# EAGLE design Fishboard (EAGLE 7.7.0)
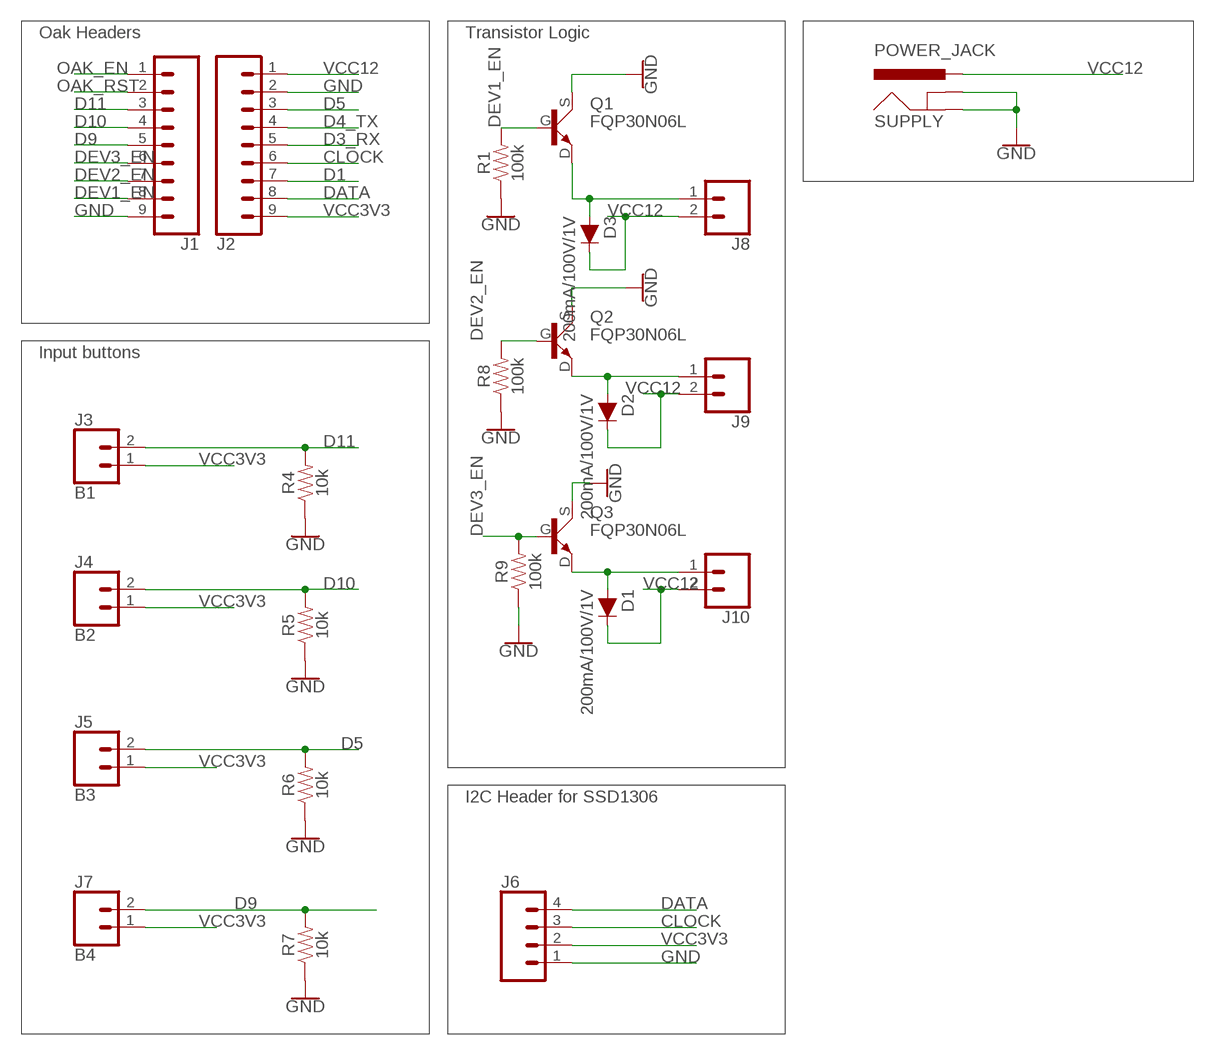
[diagram p0: schematic, sheet 1]

## Parts
D1  200mA/100V/1V  DIODE-KIT  [DIODE-1N4148-KIT]
D2  200mA/100V/1V  DIODE-KIT  [DIODE-1N4148-KIT]
D3  200mA/100V/1V  DIODE-KIT  [DIODE-1N4148-KIT]
J1  CONN_09LOCK  [1X09_LOCK]
J2  CONN_09LOCK  [1X09_LOCK]
J3  B1  CONN_02LOCK  [1X02_LOCK]
J4  B2  CONN_02LOCK  [1X02_LOCK]
J5  B3  CONN_02LOCK  [1X02_LOCK]
J6  CONN_04LOCK  [1X04_LOCK]
J7  B4  CONN_02LOCK  [1X02_LOCK]
J8  CONN_02PTH3  [1X02_LONGPADS]
J9  CONN_02PTH3  [1X02_LONGPADS]
J10  CONN_02PTH3  [1X02_LONGPADS]
Q1  FQP30N06L  [TO220]
Q2  FQP30N06L  [TO220]
Q3  FQP30N06L  [TO220]
R1  100k  100KOHM-HORIZ-1/4W-5%  [AXIAL-0.3]
R4  10k  10KOHM-HORIZ-1/4W-1%  [AXIAL-0.3]
R5  10k  10KOHM-HORIZ-1/4W-1%  [AXIAL-0.3]
R6  10k  10KOHM-HORIZ-1/4W-1%  [AXIAL-0.3]
R7  10k  10KOHM-HORIZ-1/4W-1%  [AXIAL-0.3]
R8  100k  100KOHM-HORIZ-1/4W-5%  [AXIAL-0.3]
R9  100k  100KOHM-HORIZ-1/4W-5%  [AXIAL-0.3]
SUPPLY  POWER_JACK  [POWER_JACK_PTH]

## Nets
CLOCK: J2.6 J6.3
D1: J2.7
D3_RX: J2.5
D4_TX: J2.4
D5: J2.3 J5.2 R6.P$2
D9: J1.5 J7.2 R7.P$2
D10: J1.4 J4.2 R5.P$2
D11: J1.3 J3.2 R4.P$2
DATA: J2.8 J6.4
DEV1_EN: J1.8 Q1.G R1.P$2
DEV2_EN: J1.7 Q2.G R8.P$2
DEV3_EN: J1.6 Q3.G R9.P$2
GND: J1.9 J2.2 J6.1 Q1.S Q2.S Q3.S R1.P$1 R4.P$1 R5.P$1 R6.P$1 R7.P$1 R8.P$1 R9.P$1 SUPPLY.GND SUPPLY.GNDBREAK
N$1: D2.A J9.1 Q2.D
N$2: D3.A J8.1 Q1.D
N$4: D1.A J10.1 Q3.D
OAK_EN: J1.1
OAK_RST: J1.2
VCC3V3: J2.9 J3.1 J4.1 J5.1 J6.2 J7.1
VCC12: D1.C D2.C D3.C J2.1 J8.2 J9.2 J10.2 SUPPLY.PWR

## Notes on the sheet
- Oak Headers | Transistor Logic
- Input buttons
- I2C Header for SSD1306

## Library data of the parts
D1-D3 = SparkFun-DiscreteSemi:DIODE: Diode These are standard reverse protection diodes and small signal diodes. SparkFun Products: SparkFun SparkPunk Sound Kit <https://www.sparkfun.com/products/11177> SparkFun ESP8266 Thing <https://www.sparkfun.com/products/13231>; PROD_ID: DIO-08378
J1 J2 = SparkFun-Connectors:CONN_09: Multi connection point. Often used as Generic Header-pin footprint for 0.1 inch spaced/style header connections On any of the 0.1 inch spaced packages, you can populate with these: Break Away Headers - Straight <https://www.sparkfun.com/products/116> (PRT-00116) Break Away Male Headers - Right Angle <https://www.sparkfun.com/products/553> (PRT-00553) Female Headers <https://www.sparkfun.com/products/115> (PRT-00115) Break Away Headers - Machine Pin <https://www.sparkfun.com/products/117> (PRT-00117) Break Away Female Headers - Swiss Machine Pin <https://www.sparkfun.com/products/743> (PRT-00743) For SCREWTERMINALS and SPRING TERMINALS visit here: Screw Terimnals on SparkFun.com <https://www.sparkfun.com/search/results?term=Screw+Terminals> (5mm/3.5mm/2.54mm spacing) This device is also useful as a general connection point to wire up your design to another part of your project. Our various solder wires solder well into these plated through hole pads. Hook-Up Wire - Assortment (Stranded, 22 AWG) <https://www.sparkfun.com/products/11375> (PRT-11375) Hook-Up Wire - Assortment (Solid Core, 22 AWG) <https://www.sparkfun.com/products/11367> (PRT-11367) View the entire wire category on our website here <https://www.sparkfun.com/categories/141> Special notes: Molex polarized connector foot print use with SKU : PRT-08231 with associated crimp pins and housings. 1MM SMD Version SKU: PRT-10208 NOTES ON THE VARIANTS LOCK and LOCK_LONGPADS... This footprint was designed to help hold the alignment of a through-hole component (i.e. 6-pin header) while soldering it into place. You may notice that each hole has been shifted either up or down by 0.005 of an inch from it's more standard position (which is a perfectly straight line). This slight alteration caused the pins (the squares in the middle) to touch the edges of the holes. Because they are alternating, it causes a "brace" to hold the component in place. 0.005 has proven to be the perfect amount of "off-center" position when using our standard breakaway headers. Although looks a little odd when you look at the bare footprint, once you have a header in there, the alteration is very hard to notice. Also,if you push a header all the way into place, it is covered up entirely on the bottom side.
J3-J5 J7-J10 = SparkFun-Connectors:CONN_02: Multi connection point. Often used as Generic Header-pin footprint for 0.1 inch spaced/style header connections On any of the 0.1 inch spaced packages, you can populate with these: Break Away Headers - Straight <https://www.sparkfun.com/products/116> (PRT-00116) Break Away Male Headers - Right Angle <https://www.sparkfun.com/products/553> (PRT-00553) Female Headers <https://www.sparkfun.com/products/115> (PRT-00115) Break Away Headers - Machine Pin <https://www.sparkfun.com/products/117> (PRT-00117) Break Away Female Headers - Swiss Machine Pin <https://www.sparkfun.com/products/743> (PRT-00743) For SCREWTERMINALS and SPRING TERMINALS visit here: Screw Terimnals on SparkFun.com <https://www.sparkfun.com/search/results?term=Screw+Terminals> (5mm/3.5mm/2.54mm spacing) This device is also useful as a general connection point to wire up your design to another part of your project. Our various solder wires solder well into these plated through hole pads. Hook-Up Wire - Assortment (Stranded, 22 AWG) <https://www.sparkfun.com/products/11375> (PRT-11375) Hook-Up Wire - Assortment (Solid Core, 22 AWG) <https://www.sparkfun.com/products/11367> (PRT-11367) View the entire wire category on our website here <https://www.sparkfun.com/categories/141> Special notes: Molex polarized connector foot print use with: PRT-08233 with associated crimp pins and housings. 2.54_SCREWTERM for use with PRT-10571. 3.5mm Screw Terminal footprints for PRT-08084 5mm Screw Terminal footprints for use with PRT-08432
J6 = SparkFun-Connectors:CONN_04: Multi connection point. Often used as Generic Header-pin footprint for 0.1 inch spaced/style header connections On any of the 0.1 inch spaced packages, you can populate with these: Break Away Headers - Straight <https://www.sparkfun.com/products/116> (PRT-00116) Break Away Male Headers - Right Angle <https://www.sparkfun.com/products/553> (PRT-00553) Female Headers <https://www.sparkfun.com/products/115> (PRT-00115) Break Away Headers - Machine Pin <https://www.sparkfun.com/products/117> (PRT-00117) Break Away Female Headers - Swiss Machine Pin <https://www.sparkfun.com/products/743> (PRT-00743) For SCREWTERMINALS and SPRING TERMINALS visit here: Screw Terimnals on SparkFun.com <https://www.sparkfun.com/search/results?term=Screw+Terminals> (5mm/3.5mm/2.54mm spacing) This device is also useful as a general connection point to wire up your design to another part of your project. Our various solder wires solder well into these plated through hole pads. Hook-Up Wire - Assortment (Stranded, 22 AWG) <https://www.sparkfun.com/products/11375> (PRT-11375) Hook-Up Wire - Assortment (Solid Core, 22 AWG) <https://www.sparkfun.com/products/11367> (PRT-11367) View the entire wire category on our website here <https://www.sparkfun.com/categories/141> Special notes: Molex polarized connector foot print use with SKU : PRT-08231 with associated crimp pins and housings. 1MM SMD Version SKU: PRT-10208; PROD_ID: CONN-09696
Q1-Q3 = fishlib:FQP30N06L
R1 R8 R9 = SparkFun-Resistors:100KOHM: 100kΩ resistor A resistor is a passive two-terminal electrical component that implements electrical resistance as a circuit element. Resistors act to reduce current flow, and, at the same time, act to lower voltage levels within circuits. - Wikipedia; PROD_ID: RES-10686
R4-R7 = SparkFun-Resistors:10KOHM: 10kΩ resistor A resistor is a passive two-terminal electrical component that implements electrical resistance as a circuit element. Resistors act to reduce current flow, and, at the same time, act to lower voltage levels within circuits. - Wikipedia; PROD_ID: RES-12183
SUPPLY = SparkFun-Connectors:POWER_JACK: Power Jack Connector This is the standard 5.5mm barrel jack for power. The PTH is the most common, proven, reliable, footprint. The Slot footprint only works if the mill layer is transmitted to the PCB fab house so be warned. Here are the connectors we sell at SparkFun: DC Barrel Power Jack/Connector <https://www.sparkfun.com/products/119> (PRT-00119) DC Barrel Power Jack/Connector (SMD) <https://www.sparkfun.com/products/12748> (PRT-12748) DC Barrel Jack Adapter - Breadboard Compatible <https://www.sparkfun.com/products/10811> (PRT-10811) It is used on this SparkFun product (and many, many others): SparkFun RedBoard - Programmed with Arduino <https://www.sparkfun.com/products/12757> (DEV-12757) Also, if you need a mating power supply or connector, please check these out: Wall Adapter Power Supply - 9VDC 650mA <https://www.sparkfun.com/products/298> (TOL-00298) DC Barrel Jack Adapter - Male <https://www.sparkfun.com/products/10287> (PRT-10287); PROD_ID: CONN-08197

## Board
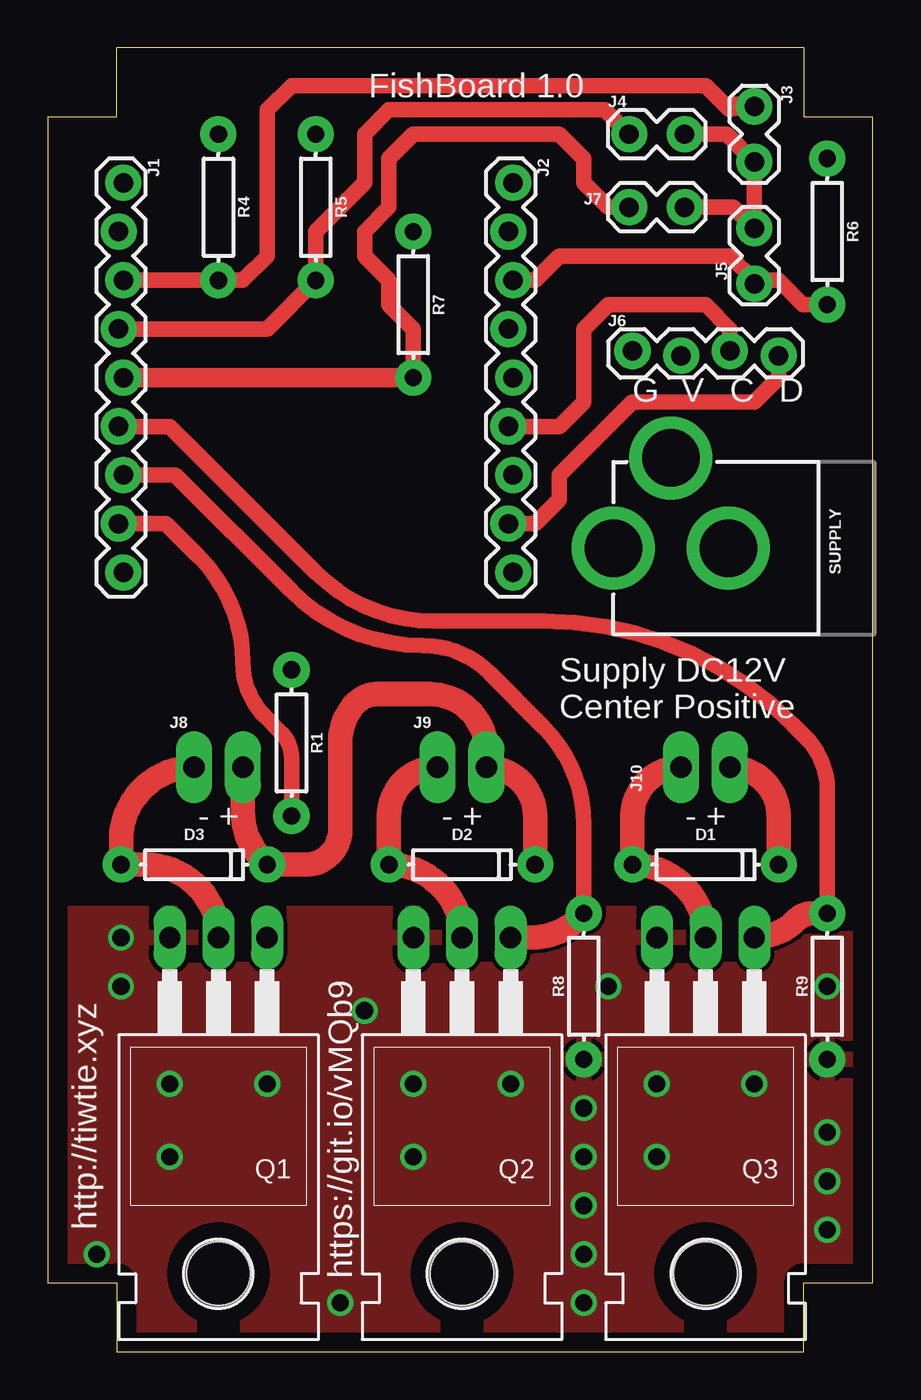
[diagram p1: board, top side]
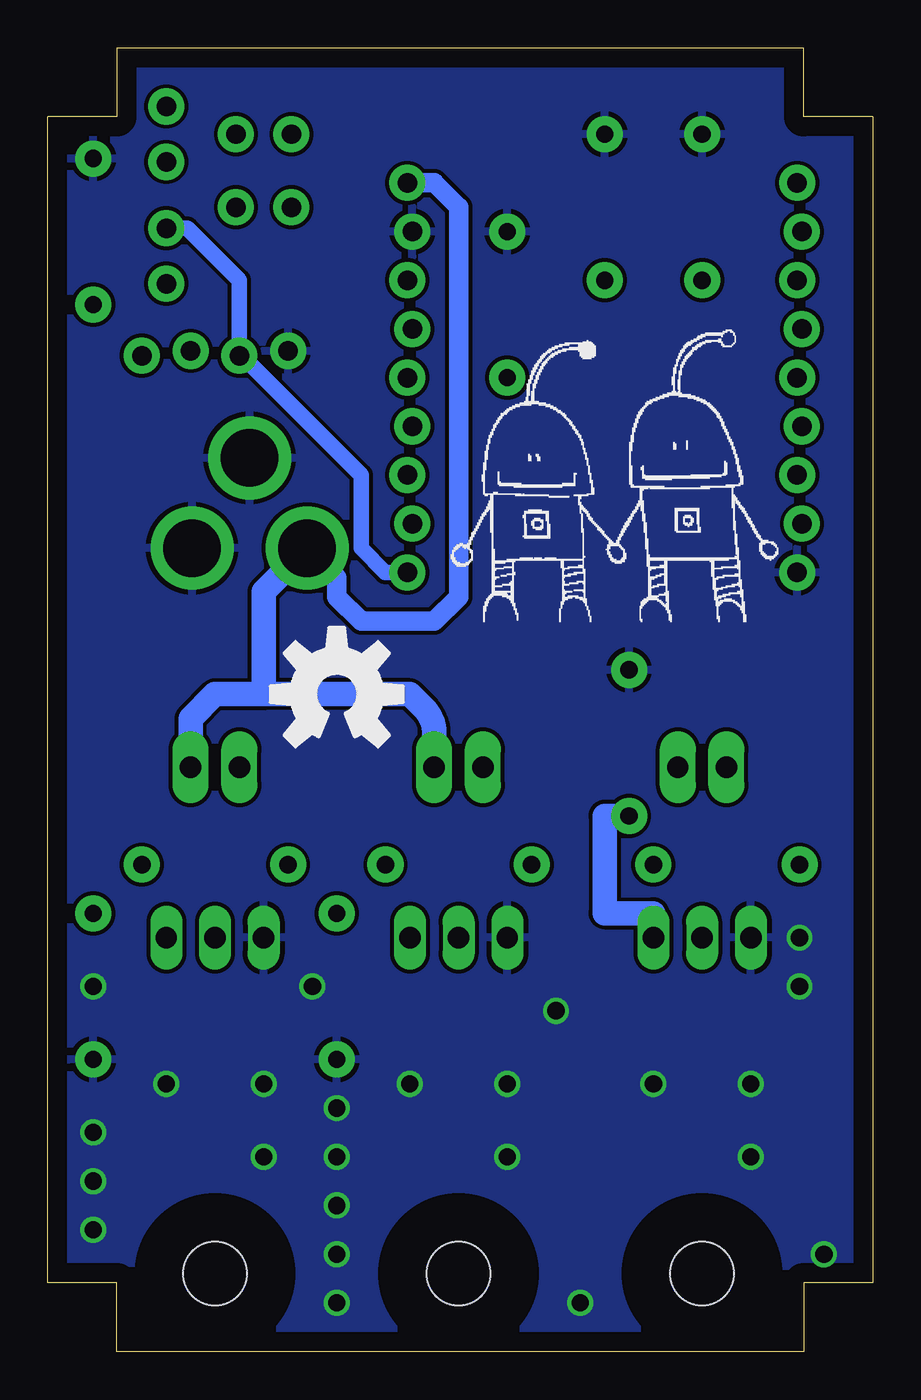
[diagram p2: board, bottom side, seen from below]

Size 43 x 68 mm. Coordinates in mm from the lower left corner, seen from the top.
Outline: 3.6,0 39.4,0 39.4,3.6 43,3.6 43,64.4 39.4,64.4 39.4,68 3.6,68 3.6,64.4 0,64.4 0,3.6 3.6,3.6 3.6,0
Copper layers (1*16): Top 0.035mm / dielectric 1.5mm / Bottom 0.035mm
Design rules "default": minimum track width 10mil, minimum drill 24mil, track to track 8mil, track to pad 8mil, pad to pad 8mil, via to via 8mil, smd to smd 8mil, copper to edge 40mil, drill to drill 8mil, minimum pad ring 10mil, minimum via ring 8mil, stop-mask expansion 4mil, vias tented up to drill 0mil, thermal gap 10mil

### Footprints (pad centres in the part's own frame; a part is rotated, then mirrored left to right if it is on the bottom)
DIODE-1N4148-KIT = drill 0.9 pad 1.88: A -3.81,0; C 3.81,0
1X09_LOCK = drill 1.016 pad 1.88: 1 0,0.127; 2 2.54,-0.127; 3 5.08,0.127; 4 7.62,-0.127; 5 10.16,0.127; 6 12.7,-0.127; 7 15.24,0.127; 8 17.78,-0.127; 9 20.32,0.127
1X02_LOCK = drill 1.016 pad 1.88: 1 -0.178,0; 2 2.718,0
1X04_LOCK = drill 1.016 pad 1.88: 1 0,0.127; 2 2.54,-0.127; 3 5.08,0.127; 4 7.62,-0.127
1X02_LONGPADS = drill 1.118 pad 1.88 long: 1 0,0; 2 2.54,0
TO220 = drill 1.118 long: D 0,-6.35; G -2.54,-6.35; S 2.54,-6.35 | hole 3.302: 0,11.176
AXIAL-0.3 = drill 0.9 pad 1.88: P$1 -3.81,0; P$2 3.81,0
POWER_JACK_PTH = drill 2.997 pad 4.318: GND 0,7.7; GNDBREAK 4.7,10.7; PWR 0,13.7

### Placement (x,y rotation side)
D1  34.29,25.4 0 top
D2  21.59,25.4 0 top
D3  7.62,25.4 0 top
J1  3.81,60.96 270 top
J2  24.13,60.96 270 top
J3  36.83,62.23 90 top
J4  33.02,63.5 180 top
J5  36.83,58.42 270 top
J6  30.48,52.07 0 top
J7  33.02,59.69 180 top
J8  7.62,30.48 0 top
J9  20.32,30.48 0 top
J10  33.02,30.48 0 top
Q1  8.89,15.24 180 top
Q2  21.59,15.24 180 top
Q3  34.29,15.24 180 top
R1  12.7,31.75 270 top
R4  8.89,59.69 270 top
R5  13.97,59.69 270 top
R6  40.64,58.42 270 top
R7  19.05,54.61 270 top
R8  27.94,19.05 90 top
R9  40.64,19.05 90 top
SUPPLY  43.18,41.91 90 top
U$1  [TIWTIE_LOGO]  22.86,38.1 0 bottom
U$2  [OSHW-LOGO-L]  27.94,34.29 0 bottom

### Tracks (layer width: path | path; a pad name or v marks a point on that pad's centre or on a via)
CLOCK
  Top 0.813: J2.6 26.67,48.26 27.94,49.53 27.94,53.34 29.21,54.61 34.29,54.61 35.56,53.34 J6.3
D5
  Top 0.813: J2.3 25.4,55.88 26.67,57.15 35.56,57.15 36.83,55.88 36.65,55.88 J5.2 37.01,55.88 38.1,55.88 39.37,54.61 R6.P$2
D9
  Top 0.813: R7.P$2 19.05,53.34 17.78,54.61 17.78,55.88 16.51,57.15 16.51,58.42 17.78,59.69 17.78,62.23 19.05,63.5 26.67,63.5 27.94,62.23 27.94,60.96 29.21,59.69 J7.2
  Top 1.016: J1.5 R7.P$2
D10
  Top 0.813: J1.4 11.43,53.34 R5.P$2 13.97,58.42 16.51,60.96 16.51,63.5 17.78,64.77 29.03,64.77 J4.2
D11
  Top 0.813: J1.3 R4.P$2 10.16,55.88 11.43,57.15 11.43,64.77 12.7,66.04 34.29,66.04 35.56,64.77 35.56,64.95
  Top 1.016: 35.56,64.95 J3.2
DATA
  Top 0.813: J2.8 25.4,43.18 26.67,44.45 26.67,45.72 30.48,49.53 36.83,49.53 38.1,50.8 J6.4
DEV1_EN
  Top 0.813: J1.8 6.14,43.18 7.89,41.43 arc-45 10.16,35.95 arc45 11.34,33.11 12.17,32.28 arc-45 12.7,31.01 R1.P$2
  Bottom 1.27: R1.P$2 13.97,27.94 13.97,22.86 11.43,22.86 Q1.G
DEV2_EN
  Top 0.813: J1.7 6.65,45.72 12.7,39.67 arc45 19.56,36.83 arc-45 23.03,35.39 25.84,32.58 arc-45 27.94,27.5 R8.P$2
  Top 1.27: R8.P$2 27.72,22.64 arc-45 25.18,21.59 Q2.G
DEV3_EN
  Top 0.813: J1.6 6.35,48.26 13.97,40.64 arc45 20.1,38.1 25.89,38.1 arc-45 38.81,32.75 39.49,32.06 arc-45 40.64,29.3 R9.P$2
  Top 1.27: Q3.G arc45 39,22.49 arc-45 39.9,22.86 R9.P$2
GND  (via drill 0.9)
  other vias: 16.51,17.78 3.81,19.05 3.81,21.59 27.94,12.7 27.94,10.16 27.94,7.62 27.94,5.08 40.64,11.43 40.64,8.89 40.64,6.35 2.54,5.08 29.21,19.05 40.64,19.05 6.35,13.97 6.35,10.16 11.43,13.97 19.05,13.97 24.13,13.97 19.05,10.16 36.83,13.97 31.75,13.97 31.75,10.16 15.24,2.54 27.94,2.54
  pour Bottom: 0,67.31 0,0 43.18,0 43.18,67.31
  pour Top: 0,22.86 43.18,22.86 43.18,3.81 39.37,3.81 39.37,0 3.81,0 3.81,3.81 0,3.81
N$1
  Top 1.27: J9.1 arc90 17.78,27.94 D2.A arc-90 Q2.D
N$2
  Top 1.27: Q1.D arc90 5.08,25.4 D3.A 3.81,26.67 arc-90 J8.1
N$4
  Top 1.27: J10.1 arc90 30.48,27.94 D1.A arc-90 Q3.D
VCC3V3
  Top 0.813: J4.1 35.38,63.5 J3.1 J5.1 35.74,59.69 J7.1
  Bottom 0.813: J5.1 35.74,58.6 33.02,55.88 J6.2 32.89,51.94 26.67,45.72 26.67,41.91 25.4,40.64 J2.9
VCC12
  Top 1.27: D2.C 25.4,27.94 arc90 J9.2 22.86,31.36 arc90 19.93,34.29 17.13,34.29 arc45 16.07,33.85 arc45 15.24,31.84 15.24,27.2 arc-90 13.44,25.4 D3.C 11.21,25.62 arc-45 10.16,28.16 J8.2 | D1.C 38.1,27.94 arc90 J10.2
  Bottom 1.016: J2.1 22.86,60.96 21.59,59.69 21.59,39.37 22.86,38.1 26.67,38.1 27.94,39.37 27.94,40.37 SUPPLY.PWR
  Bottom 1.27: J10.2 35.56,33.02 34.29,34.29 31.75,34.29 | J9.2 22.86,32.28 arc-45 23.39,33.55 24.13,34.29 31.75,34.29 | 31.75,34.29 31.75,39.64 SUPPLY.PWR

### Text on the board
tNames: FishBoard 1.0 | G | V | C | D | Supply DC12V / Center Positive | - + | - + | - + | http://tiwtie.xyz | https://git.io/vMQb9